# EAGLE design conveyor-pcb (EAGLE 8.2.2)
Copyright 2018 Amazon.com, Inc. or its affiliates. All Rights Reserved. SPDX-License-Identifier: Apache-2.0
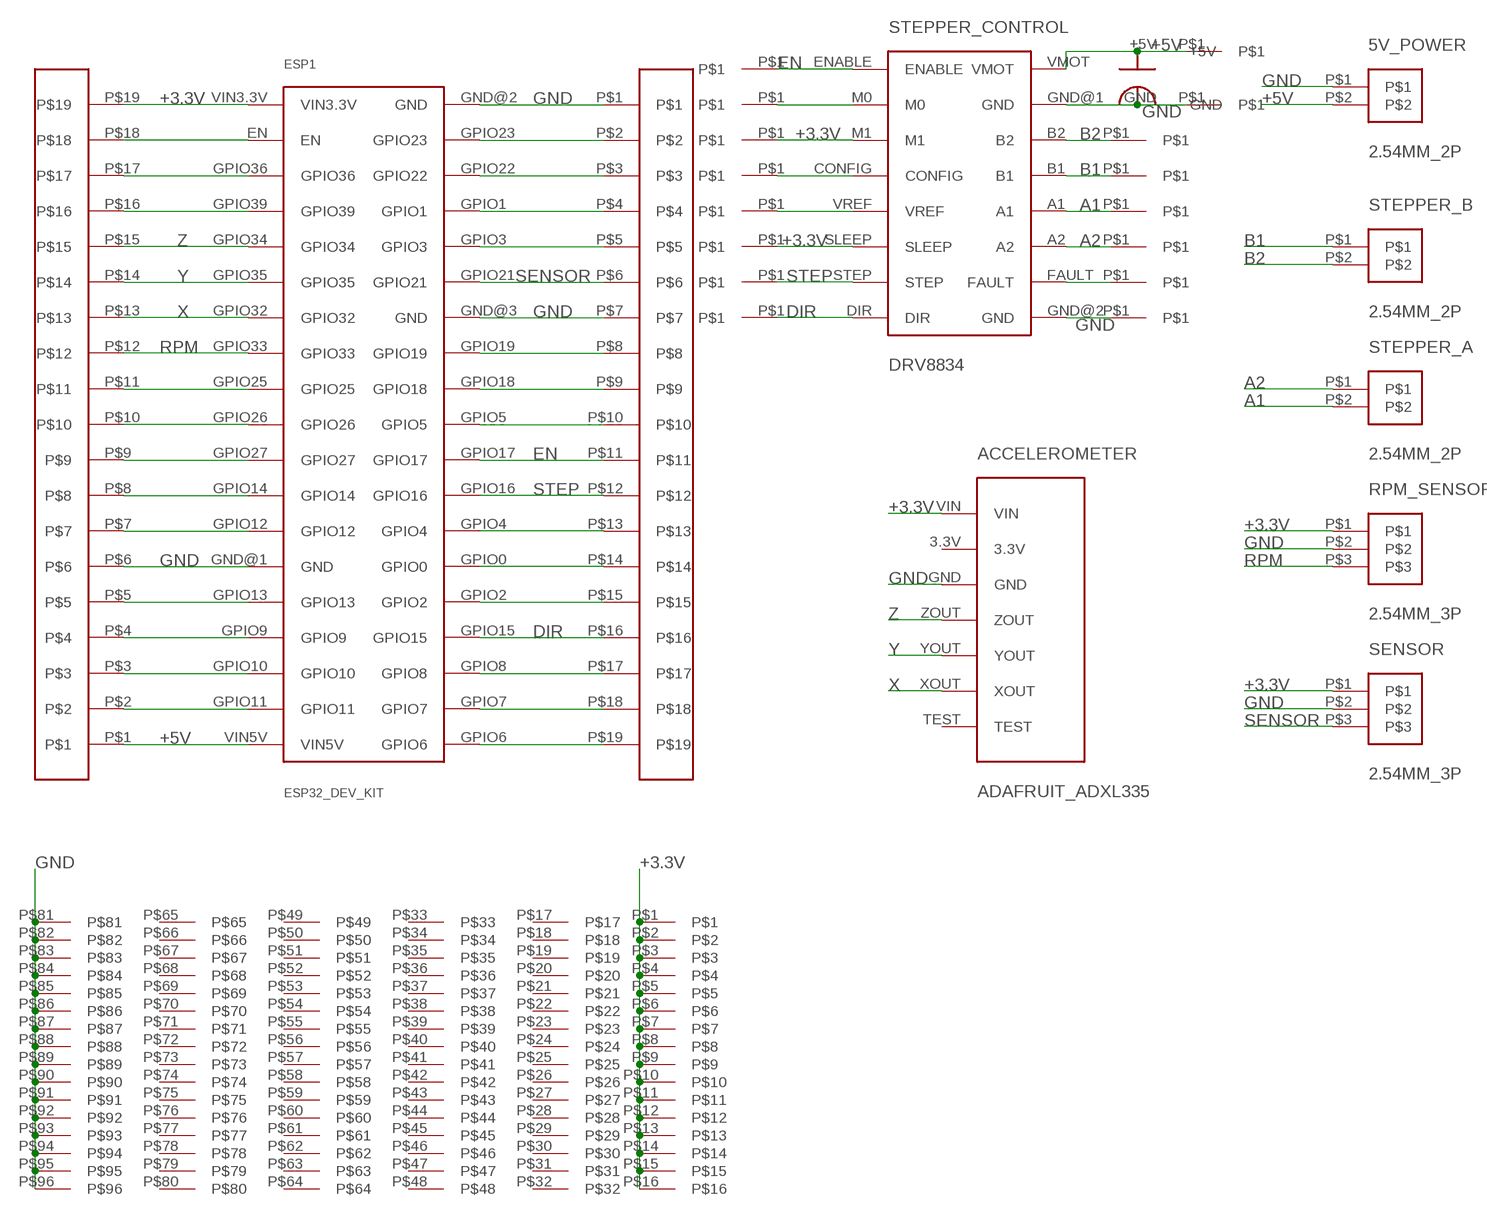
[diagram p0: schematic, sheet 1]

## Parts
5V_POWER  2.54MM_2P  [2.54MM_2P]
ACCELEROMETER  ADAFRUIT_ADXL335  [ADAFRUIT_ADXL335]
ESP1  ESP32_DEV_KIT  [ESP32_DEV_KIT]
RPM_SENSOR  2.54MM_3P  [2.54MM_3P]
SENSOR  2.54MM_3P  [2.54MM_3P]
STEPPER_A  2.54MM_2P  [2.54MM_2P]
STEPPER_B  2.54MM_2P  [2.54MM_2P]
STEPPER_CONTROL  DRV8834  [DRV8834]
U$1  19PINHEADER  [19PINHEADER]
U$2  19PINHEADER  [19PINHEADER]
U$3  PERFBOARD_CONVEYOR  [PERFBOARD_CONVEYOR]
U$4  1PIN_HEADER  [1PIN_HEADER]
U$5  1PIN_HEADER  [1PIN_HEADER]
U$6  1PIN_HEADER  [1PIN_HEADER]
U$7  1PIN_HEADER  [1PIN_HEADER]
U$8  1PIN_HEADER  [1PIN_HEADER]
U$9  1PIN_HEADER  [1PIN_HEADER]
U$10  1PIN_HEADER  [1PIN_HEADER]
U$11  1PIN_HEADER  [1PIN_HEADER]
U$12  1PIN_HEADER  [1PIN_HEADER]
U$13  1PIN_HEADER  [1PIN_HEADER]
U$14  1PIN_HEADER  [1PIN_HEADER]
U$15  1PIN_HEADER  [1PIN_HEADER]
U$16  1PIN_HEADER  [1PIN_HEADER]
U$17  1PIN_HEADER  [1PIN_HEADER]
U$18  1PIN_HEADER  [1PIN_HEADER]
U$19  1PIN_HEADER  [1PIN_HEADER]
U$20  CAP_100UF  [CAP_100UF]

## Nets
+3.3V: ACCELEROMETER.VIN ESP1.VIN3.3V RPM_SENSOR.P$1 SENSOR.P$1 STEPPER_CONTROL.M1 STEPPER_CONTROL.SLEEP U$2.P$19 U$3.P$1 U$3.P$2 U$3.P$3 U$3.P$4 U$3.P$5 U$3.P$6 U$3.P$7 U$3.P$8 U$3.P$9 U$3.P$10 U$3.P$11 U$3.P$12 U$3.P$13 U$3.P$14 U$3.P$15 U$3.P$16 U$6.P$1 U$9.P$1
+5V: 5V_POWER.P$2 ESP1.VIN5V STEPPER_CONTROL.VMOT U$2.P$1 U$19.P$1 U$20.+5V
A1: STEPPER_A.P$2 STEPPER_CONTROL.A1 U$15.P$1
A2: STEPPER_A.P$1 STEPPER_CONTROL.A2 U$14.P$1
B1: STEPPER_B.P$1 STEPPER_CONTROL.B1 U$16.P$1
B2: STEPPER_B.P$2 STEPPER_CONTROL.B2 U$17.P$1
DIR: ESP1.GPIO15 STEPPER_CONTROL.DIR U$1.P$16 U$11.P$1
EN: ESP1.GPIO17 STEPPER_CONTROL.ENABLE U$1.P$11 U$4.P$1
GND: 5V_POWER.P$1 ACCELEROMETER.GND ESP1.GND@1(GND) ESP1.GND@2(GND) ESP1.GND@3(GND) RPM_SENSOR.P$2 SENSOR.P$2 STEPPER_CONTROL.GND@1(GND) STEPPER_CONTROL.GND@2(GND) U$1.P$1 U$1.P$7 U$2.P$6 U$3.P$81 U$3.P$82 U$3.P$83 U$3.P$84 U$3.P$85 U$3.P$86 U$3.P$87 U$3.P$88 U$3.P$89 U$3.P$90 U$3.P$91 U$3.P$92 U$3.P$93 U$3.P$94 U$3.P$95 U$3.P$96 U$12.P$1 U$18.P$1 U$20.GND
N$2: STEPPER_CONTROL.M0 U$5.P$1
N$3: STEPPER_CONTROL.CONFIG U$7.P$1
N$4: STEPPER_CONTROL.VREF U$8.P$1
N$5: ESP1.GPIO11 U$2.P$2
N$6: ESP1.GPIO10 U$2.P$3
N$7: ESP1.GPIO9 U$2.P$4
N$8: ESP1.GPIO13 U$2.P$5
N$9: ESP1.GPIO12 U$2.P$7
N$10: ESP1.GPIO27 U$2.P$9
N$11: ESP1.GPIO26 U$2.P$10
N$12: ESP1.GPIO25 U$2.P$11
N$14: STEPPER_CONTROL.FAULT U$13.P$1
N$15: ESP1.EN U$2.P$18
N$16: ESP1.GPIO23 U$1.P$2
N$17: ESP1.GPIO22 U$1.P$3
N$18: ESP1.GPIO1 U$1.P$4
N$19: ESP1.GPIO3 U$1.P$5
N$20: ESP1.GPIO19 U$1.P$8
N$21: ESP1.GPIO18 U$1.P$9
N$22: ESP1.GPIO36 U$2.P$17
N$23: ESP1.GPIO5 U$1.P$10
N$26: ESP1.GPIO4 U$1.P$13
N$27: ESP1.GPIO0 U$1.P$14
N$28: ESP1.GPIO2 U$1.P$15
N$29: ESP1.GPIO8 U$1.P$17
N$30: ESP1.GPIO7 U$1.P$18
N$31: ESP1.GPIO6 U$1.P$19
P$8: ESP1.GPIO14 U$2.P$8
P$16: ESP1.GPIO39 U$2.P$16
RPM: ESP1.GPIO33 RPM_SENSOR.P$3 U$2.P$12
SENSOR: ESP1.GPIO21 SENSOR.P$3 U$1.P$6
STEP: ESP1.GPIO16 STEPPER_CONTROL.STEP U$1.P$12 U$10.P$1
X: ACCELEROMETER.XOUT ESP1.GPIO32 U$2.P$13
Y: ACCELEROMETER.YOUT ESP1.GPIO35 U$2.P$14
Z: ACCELEROMETER.ZOUT ESP1.GPIO34 U$2.P$15
Unconnected: ACCELEROMETER.3.3V ACCELEROMETER.TEST U$3.P$17 U$3.P$18 U$3.P$19 U$3.P$20 U$3.P$21 U$3.P$22 U$3.P$23 U$3.P$24 U$3.P$25 U$3.P$26 U$3.P$27 U$3.P$28 U$3.P$29 U$3.P$30 U$3.P$31 U$3.P$32 U$3.P$33 U$3.P$34 U$3.P$35 U$3.P$36 U$3.P$37 U$3.P$38 U$3.P$39 U$3.P$40 U$3.P$41 U$3.P$42 U$3.P$43 U$3.P$44 U$3.P$45 U$3.P$46 U$3.P$47 U$3.P$48 U$3.P$49 U$3.P$50 U$3.P$51 U$3.P$52 U$3.P$53 U$3.P$54 U$3.P$55 U$3.P$56 U$3.P$57 U$3.P$58 U$3.P$59 U$3.P$60 U$3.P$61 U$3.P$62 U$3.P$63 U$3.P$64 U$3.P$65 U$3.P$66 U$3.P$67 U$3.P$68 U$3.P$69 U$3.P$70 U$3.P$71 U$3.P$72 U$3.P$73 U$3.P$74 U$3.P$75 U$3.P$76 U$3.P$77 U$3.P$78 U$3.P$79 U$3.P$80

## Library data of the parts
5V_POWER STEPPER_A STEPPER_B = ScrewTerminals:2.54MM_2P
ACCELEROMETER = Adafruit:ADAFRUIT_ADXL335
ESP1 = Espressif:ESP32_DEV_KIT
RPM_SENSOR SENSOR = ScrewTerminals:2.54MM_3P
STEPPER_CONTROL = POLOLU:DRV8834
U$1 U$2 = 19pinheader:19PINHEADER
U$3 = PerfBoard:PERFBOARD_CONVEYOR
U$4-U$19 = Headers:1PIN_HEADER
U$20 = Capacitor:CAP_100UF

## Board
Copyright 2018 Amazon.com, Inc. or its affiliates. All Rights Reserved. SPDX-License-Identifier: Apache-2.0
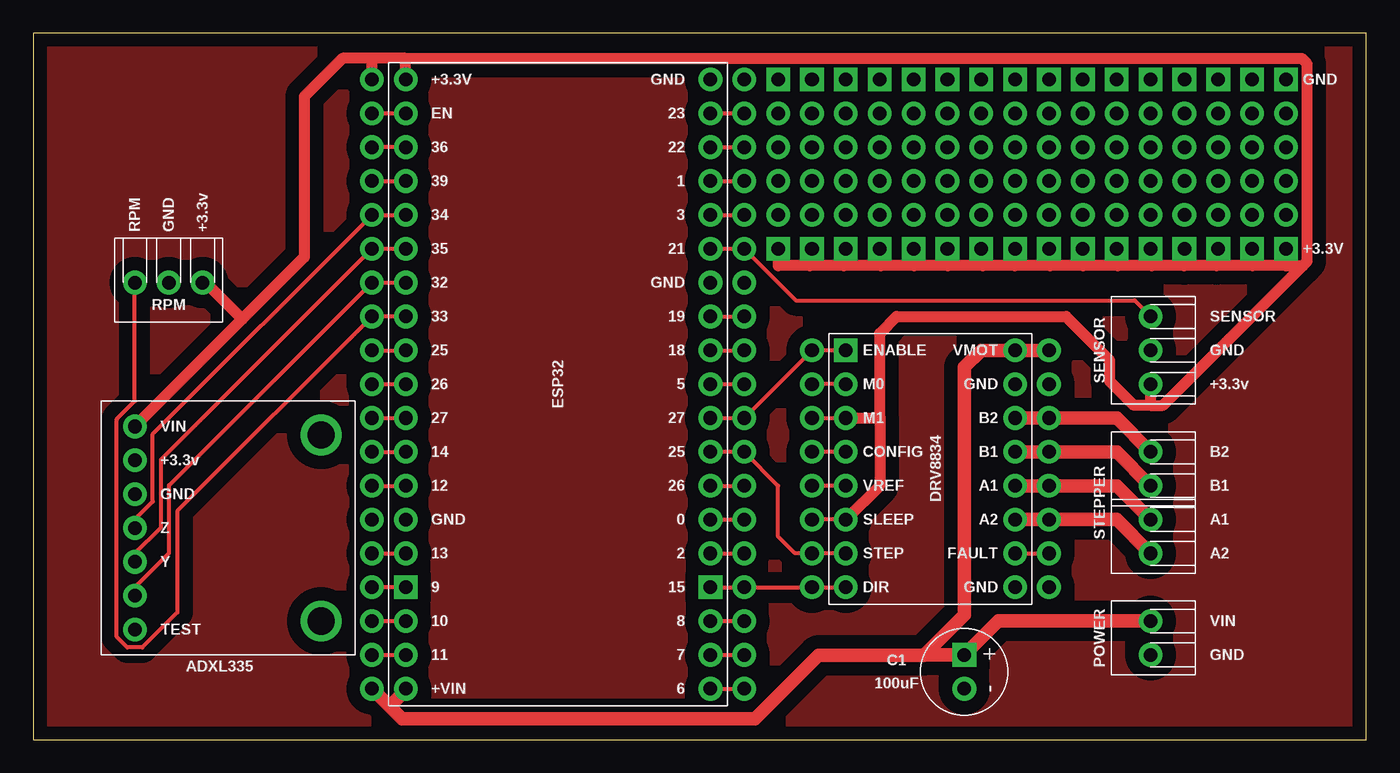
[diagram p1: board, top side]
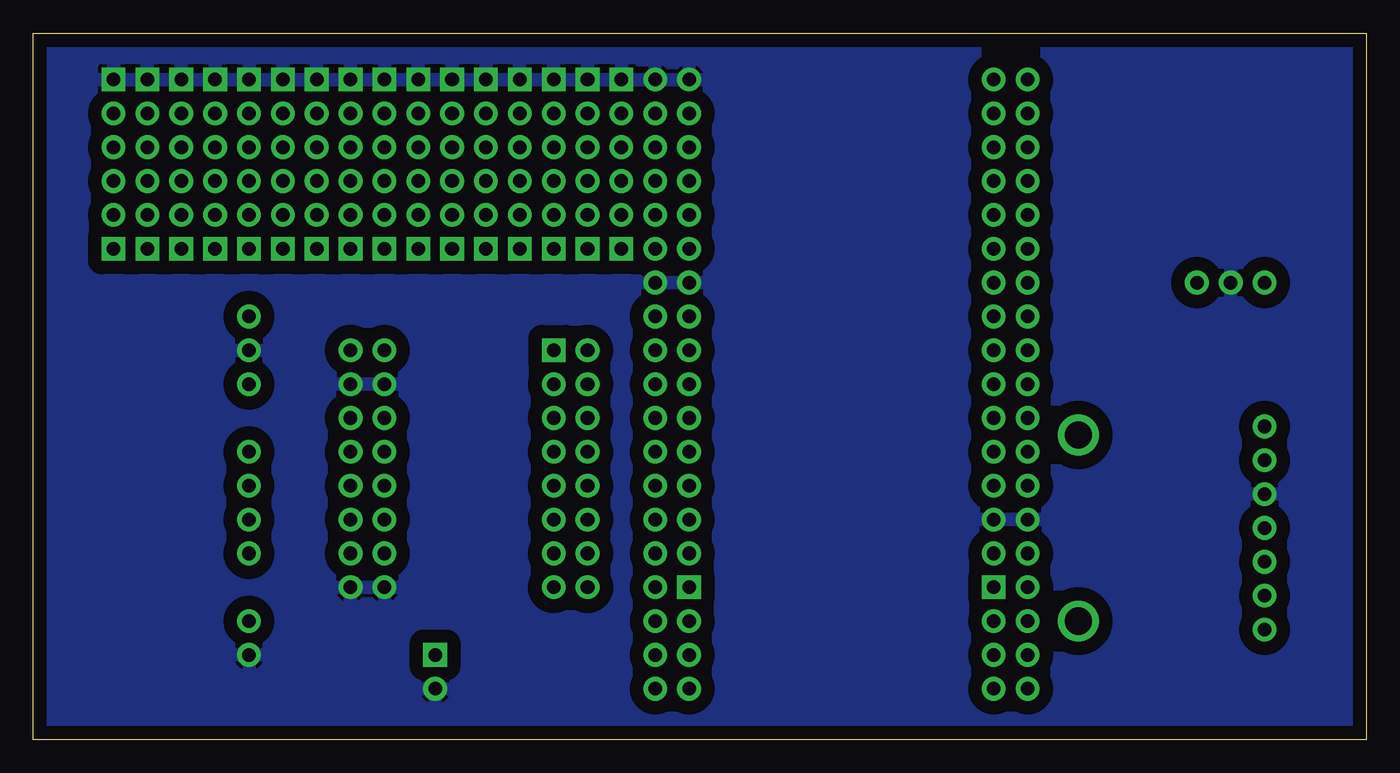
[diagram p2: board, bottom side, seen from below]

Size 100 x 53 mm. Coordinates in mm from the lower left corner, seen from the top.
Outline: 0,0 100,0 100,53 0,53 0,0
Copper layers (1*16): Top 0.035mm / dielectric 1.5mm / Bottom 0.035mm
Design rules "default *": minimum track width 12mil, minimum drill 0.35mm, track to track 12mil, track to pad 12mil, pad to pad 12mil, via to via 12mil, smd to smd 10mil, copper to edge 20mil, drill to drill 10mil, minimum pad ring 10mil, minimum via ring 8mil, stop-mask expansion 4mil, vias tented up to drill 0mil, thermal gap 10mil

### Footprints (pad centres in the part's own frame; a part is rotated, then mirrored left to right if it is on the bottom)
2.54MM_2P = drill 1.016 pad 1.778: P$1 0,0; P$2 0,-2.54
ADAFRUIT_ADXL335 = drill 1.016 pad 1.778: 3.3V 4.445,-16.51; GND 6.985,-16.51; TEST 17.145,-16.51; VIN 1.905,-16.51; XOUT 14.605,-16.51; YOUT 12.065,-16.51; ZOUT 9.525,-16.51 | drill 2.032: P$8 2.54,-2.54; P$9 16.51,-2.54
ESP32_DEV_KIT = drill 1.016 pad 1.778: EN 1.27,-3.81; GND@1 1.27,-34.29; GND@2 24.13,-1.27; GND@3 24.13,-16.51; GPIO0 24.13,-34.29; GPIO1 24.13,-8.89; GPIO2 24.13,-36.83; GPIO3 24.13,-11.43; GPIO4 24.13,-31.75; GPIO5 24.13,-24.13; GPIO6 24.13,-46.99; GPIO7 24.13,-44.45; GPIO8 24.13,-41.91; GPIO10 1.27,-41.91; GPIO11 1.27,-44.45; GPIO12 1.27,-31.75; GPIO13 1.27,-36.83; GPIO14 1.27,-29.21; GPIO16 24.13,-29.21; GPIO17 24.13,-26.67; GPIO18 24.13,-21.59; GPIO19 24.13,-19.05; GPIO21 24.13,-13.97; GPIO22 24.13,-6.35; GPIO23 24.13,-3.81; GPIO25 1.27,-21.59; GPIO26 1.27,-24.13; GPIO27 1.27,-26.67; GPIO32 1.27,-16.51; GPIO33 1.27,-19.05; GPIO34 1.27,-11.43; GPIO35 1.27,-13.97; GPIO36 1.27,-6.35; GPIO39 1.27,-8.89; VIN3.3V 1.27,-1.27; VIN5V 1.27,-46.99 | drill 1.016 pad 1.778 square: GPIO9 1.27,-39.37; GPIO15 24.13,-39.37
2.54MM_3P = drill 1.016 pad 1.778: P$1 0,0; P$2 0,-2.54; P$3 0,-5.08
DRV8834 = drill 1.016 pad 1.778: A1 12.7,-10.16; A2 12.7,-12.7; B1 12.7,-7.62; B2 12.7,-5.08; CONFIG 0,-7.62; DIR 0,-17.78; FAULT 12.7,-15.24; GND@1 12.7,-2.54; GND@2 12.7,-17.78; M0 0,-2.54; M1 0,-5.08; SLEEP 0,-12.7; STEP 0,-15.24; VMOT 12.7,0; VREF 0,-10.16 | drill 1.016 pad 1.778 square: ENABLE 0,0
19PINHEADER = drill 1.016 pad 1.778: P$1 0,0; P$2 0,-2.54; P$3 0,-5.08; P$4 0,-7.62; P$5 0,-10.16; P$6 0,-12.7; P$7 0,-15.24; P$8 0,-17.78; P$9 0,-20.32; P$10 0,-22.86; P$11 0,-25.4; P$12 0,-27.94; P$13 0,-30.48; P$14 0,-33.02; P$15 0,-35.56; P$16 0,-38.1; P$17 0,-40.64; P$18 0,-43.18; P$19 0,-45.72
PERFBOARD_CONVEYOR = drill 1.016 pad 1.778 square: P$1 0,0; P$2 2.54,0; P$3 5.08,0; P$4 7.62,0; P$5 10.16,0; P$6 12.7,0; P$7 15.24,0; P$8 17.78,0; P$9 20.32,0; P$10 22.86,0; P$11 25.4,0; P$12 27.94,0; P$13 30.48,0; P$14 33.02,0; P$15 35.56,0; P$16 38.1,0; P$81 0,-12.7; P$82 2.54,-12.7; P$83 5.08,-12.7; P$84 7.62,-12.7; P$85 10.16,-12.7; P$86 12.7,-12.7; P$87 15.24,-12.7; P$88 17.78,-12.7; P$89 20.32,-12.7; P$90 22.86,-12.7; P$91 25.4,-12.7; P$92 27.94,-12.7; P$93 30.48,-12.7; P$94 33.02,-12.7; P$95 35.56,-12.7; P$96 38.1,-12.7 | drill 1.016 pad 1.778: P$17 0,-2.54; P$18 2.54,-2.54; P$19 5.08,-2.54; P$20 7.62,-2.54; P$21 10.16,-2.54; P$22 12.7,-2.54; P$23 15.24,-2.54; P$24 17.78,-2.54; P$25 20.32,-2.54; P$26 22.86,-2.54; P$27 25.4,-2.54; P$28 27.94,-2.54; P$29 30.48,-2.54; P$30 33.02,-2.54; P$31 35.56,-2.54; P$32 38.1,-2.54; P$33 38.1,-5.08; P$34 35.56,-5.08; P$35 33.02,-5.08; P$36 30.48,-5.08; P$37 27.94,-5.08; P$38 25.4,-5.08; P$39 22.86,-5.08; P$40 20.32,-5.08; P$41 17.78,-5.08; P$42 15.24,-5.08; P$43 12.7,-5.08; P$44 10.16,-5.08; P$45 7.62,-5.08; P$46 5.08,-5.08; P$47 2.54,-5.08; P$48 0,-5.08; P$49 0,-7.62; P$50 2.54,-7.62; P$51 5.08,-7.62; P$52 7.62,-7.62; P$53 10.16,-7.62; P$54 12.7,-7.62; P$55 15.24,-7.62; P$56 17.78,-7.62; P$57 20.32,-7.62; P$58 22.86,-7.62; P$59 25.4,-7.62; P$60 27.94,-7.62; P$61 30.48,-7.62; P$62 33.02,-7.62; P$63 35.56,-7.62; P$64 38.1,-7.62; P$65 38.1,-10.16; P$66 35.56,-10.16; P$67 33.02,-10.16; P$68 30.48,-10.16; P$69 27.94,-10.16; P$70 25.4,-10.16; P$71 22.86,-10.16; P$72 20.32,-10.16; P$73 17.78,-10.16; P$74 15.24,-10.16; P$75 12.7,-10.16; P$76 10.16,-10.16; P$77 7.62,-10.16; P$78 5.08,-10.16; P$79 2.54,-10.16; P$80 0,-10.16
1PIN_HEADER = drill 1.016 pad 1.778: P$1 0,0
CAP_100UF = drill 1.016 pad 1.778 square: +5V -1.27,0 | drill 1.016 pad 1.778: GND 1.27,0

### Placement (x,y rotation side)
5V_POWER  83.82,6.35 180 top
ACCELEROMETER  24.13,25.4 270 top
ESP1  26.67,50.8 0 top
RPM_SENSOR  12.7,34.29 270 top
SENSOR  83.82,26.67 180 top
STEPPER_A  83.82,13.97 180 top
STEPPER_B  83.82,19.05 180 top
STEPPER_CONTROL  60.96,29.21 0 top
U$1  53.34,49.53 0 top
U$2  25.4,3.81 180 top
U$3  93.98,36.83 180 top
U$4  58.42,29.21 0 top
U$5  58.42,26.67 0 top
U$6  58.42,24.13 0 top
U$7  58.42,21.59 0 top
U$8  58.42,19.05 0 top
U$9  58.42,16.51 0 top
U$10  58.42,13.97 0 top
U$11  58.42,11.43 0 top
U$12  76.2,11.43 0 top
U$13  76.2,13.97 0 top
U$14  76.2,16.51 90 top
U$15  76.2,19.05 0 top
U$16  76.2,21.59 0 top
U$17  76.2,24.13 0 top
U$18  76.2,26.67 0 top
U$19  76.2,29.21 0 top
U$20  69.85,5.08 270 top

### Tracks (layer width: path | path; a pad name or v marks a point on that pad's centre or on a via)
+3.3V
  Top 0.305: U$6.P$1 STEPPER_CONTROL.M1 | STEPPER_CONTROL.SLEEP U$9.P$1
  Top 0.813: 95.25,35.56 95.58,35.89 95.58,50.71 95.16,51.13 27.92,51.13 | 58.27,35.56 55.88,35.56 U$3.P$16 | 60.8,35.56 58.27,35.56 | 63.56,35.56 60.8,35.56 | 66.07,35.56 63.56,35.56 | 68.59,35.56 66.07,35.56 | 71.21,35.56 68.59,35.56 | 73.62,35.56 71.21,35.56 | 76.27,35.56 73.62,35.56 | 78.75,35.56 76.27,35.56 | 81.34,35.56 78.75,35.56 | 83.91,35.56 81.34,35.56 | 86.32,35.56 83.91,35.56 | 88.79,35.56 86.32,35.56 | 91.49,35.56 88.79,35.56 | 93.94,35.56 91.49,35.56 | 93.94,35.56 95.25,35.56 | 63.5,24.23 63.5,30.48 64.77,31.75 77.47,31.75 80.75,28.47 80.75,26.9 82.58,25.07 83.81,25.07 | 63.5,24.23 63.5,19.05 STEPPER_CONTROL.SLEEP | STEPPER_CONTROL.M1 63.4,24.13 63.5,24.23 | U$3.P$15 58.42,35.71 58.27,35.56 | U$3.P$14 60.96,35.72 60.8,35.56 | U$3.P$13 63.5,35.62 63.56,35.56 | U$3.P$12 66.04,35.59 66.07,35.56 | U$3.P$11 68.58,35.57 68.59,35.56 | U$3.P$10 71.12,35.65 71.21,35.56 | U$3.P$9 73.66,35.6 73.62,35.56 | U$3.P$8 76.2,35.63 76.27,35.56 | U$3.P$7 78.74,35.58 78.75,35.56 | U$3.P$6 81.28,35.62 81.34,35.56 | U$3.P$5 83.82,35.65 83.91,35.56 | U$3.P$4 86.36,35.6 86.32,35.56 | U$3.P$3 88.9,35.67 88.79,35.56 | U$3.P$2 91.44,35.61 91.49,35.56 | U$3.P$1 93.98,35.6 93.94,35.56 | 27.92,51.13 25.38,51.13 | ESP1.VIN3.3V 27.94,51.11 27.92,51.13 | U$2.P$19 25.4,51.11 25.38,51.13 | 83.81,25.07 84.76,25.07 95.25,35.56 | SENSOR.P$1 83.82,25.08 83.81,25.07 | 25.38,51.13 23.19,51.13 20.32,48.26 20.32,36.2 15.67,31.55 | 15.67,31.55 ACCELEROMETER.VIN | RPM_SENSOR.P$1 12.93,34.29 15.67,31.55
+5V
  Top 1.016: 73.66,29.08 STEPPER_CONTROL.VMOT | STEPPER_CONTROL.VMOT U$19.P$1 | STEPPER_CONTROL.VMOT 71.12,29.21 69.85,27.94 69.85,9.35 66.83,6.33 | 66.83,6.33 58.91,6.33 54.13,1.55 27.66,1.55 26.72,2.49 | 26.72,2.49 U$2.P$1 | ESP1.VIN5V 27.94,3.7 26.72,2.49 | 5V_POWER.P$2 72.39,8.89 U$20.+5V 66.85,6.35 66.83,6.33
A1
  Top 1.016: STEPPER_CONTROL.A1 U$15.P$1 81.28,19.05 STEPPER_A.P$2
A2
  Top 1.016: STEPPER_CONTROL.A2 U$14.P$1 81.28,16.51 STEPPER_A.P$1
B1
  Top 1.016: STEPPER_CONTROL.B1 U$16.P$1 81.28,21.59 STEPPER_B.P$1
B2
  Top 1.016: STEPPER_CONTROL.B2 U$17.P$1 81.28,24.13 STEPPER_B.P$2
DIR
  Top 0.305: ESP1.GPIO15 U$1.P$16 U$11.P$1 STEPPER_CONTROL.DIR
EN
  Top 0.305: STEPPER_CONTROL.ENABLE U$4.P$1 U$1.P$11 ESP1.GPIO17
GND
  pour Bottom (isolate 1.016): 0,0 0,53.07 100.33,53.07 100.33,0
N$1
  pour Top (isolate 1.016): 0,0 0,53.07 100.33,53.07 100.33,0
N$2
  Top 0.305: STEPPER_CONTROL.M0 U$5.P$1
N$3
  Top 0.305: STEPPER_CONTROL.CONFIG U$7.P$1
N$4
  Top 0.305: STEPPER_CONTROL.VREF U$8.P$1
N$5
  Top 0.305: U$2.P$2 ESP1.GPIO11
N$6
  Top 0.305: U$2.P$3 ESP1.GPIO10
N$7
  Top 0.305: ESP1.GPIO9 U$2.P$4
N$8
  Top 0.305: U$2.P$5 ESP1.GPIO13
N$9
  Top 0.305: U$2.P$7 ESP1.GPIO12
N$10
  Top 0.305: U$2.P$9 ESP1.GPIO27
N$11
  Top 0.305: U$2.P$10 ESP1.GPIO26
N$12
  Top 0.305: U$2.P$11 ESP1.GPIO25
N$14
  Top 0.305: STEPPER_CONTROL.FAULT U$13.P$1
N$15
  Top 0.305: U$2.P$18 ESP1.EN
N$16
  Top 0.305: ESP1.GPIO23 U$1.P$2
N$17
  Top 0.305: ESP1.GPIO22 U$1.P$3
N$18
  Top 0.305: ESP1.GPIO1 U$1.P$4
N$19
  Top 0.305: ESP1.GPIO3 U$1.P$5
N$20
  Top 0.305: ESP1.GPIO19 U$1.P$8
N$21
  Top 0.305: ESP1.GPIO18 U$1.P$9
N$22
  Top 0.305: ESP1.GPIO36 U$2.P$17
N$23
  Top 0.305: ESP1.GPIO5 U$1.P$10
N$26
  Top 0.305: ESP1.GPIO4 U$1.P$13
N$27
  Top 0.305: ESP1.GPIO0 U$1.P$14
N$28
  Top 0.305: ESP1.GPIO2 U$1.P$15
N$29
  Top 0.305: ESP1.GPIO8 U$1.P$17
N$30
  Top 0.305: ESP1.GPIO7 U$1.P$18
N$31
  Top 0.305: ESP1.GPIO6 U$1.P$19
P$8
  Top 0.305: U$2.P$8 ESP1.GPIO14
P$16
  Top 0.305: U$2.P$16 ESP1.GPIO39
RPM
  Top 0.305: ESP1.GPIO33 U$2.P$12 10.79,17.14 10.79,9.53 8.18,6.91 7.06,6.91 6.27,7.7 6.27,24.05 7.62,25.4 RPM_SENSOR.P$3
SENSOR
  Top 0.305: ESP1.GPIO21 U$1.P$6 53.34,36.8 57.2,32.94 82.63,32.94 SENSOR.P$3
STEP
  Top 0.305: STEPPER_CONTROL.STEP U$10.P$1 57.15,13.97 55.88,15.24 55.88,19.05 U$1.P$12 ESP1.GPIO16
X
  Top 0.305: ESP1.GPIO32 U$2.P$13 10.19,19.07 10.19,14 7.62,11.43 ACCELEROMETER.XOUT
Y
  Top 0.305: ESP1.GPIO35 U$2.P$14 9.58,21.01 9.58,15.93 7.62,13.97 ACCELEROMETER.YOUT
Z
  Top 0.305: ESP1.GPIO34 U$2.P$15 8.97,22.94 8.97,17.86 7.62,16.51 ACCELEROMETER.ZOUT

### Text on the board
tPlace: +3.3V | GND | GND | EN | 23 | 36 | 22 | 39 | 1 | 34 | 3 | RPM | GND | +3.3v | 35 | 21 | +3.3V | 32 | GND | RPM | 33 | 19 | SENSOR | 25 | 18 | ENABLE | VMOT | SENSOR | GND | 26 | ESP32 | 5 | M0 | GND | +3.3v | 27 | 27 | M1 | B2 | VIN | 14 | 25 | CONFIG | B1 | B2 | +3.3v | DRV8834 | 12 | 26 | VREF | A1 | B1 | GND | STEPPER | GND | 0 | SLEEP | A2 | A1 | Z | 13 | 2 | STEP | FAULT | A2 | Y | 9 | 15 | DIR | GND | 10 | 8 | VIN | TEST | POWER | 11 | 7 | C1 | GND | ADXL335 | +VIN | 6 | 100uF